# Altium schematic sheet _3_OUTPUT_RELAY.SchDoc
size B
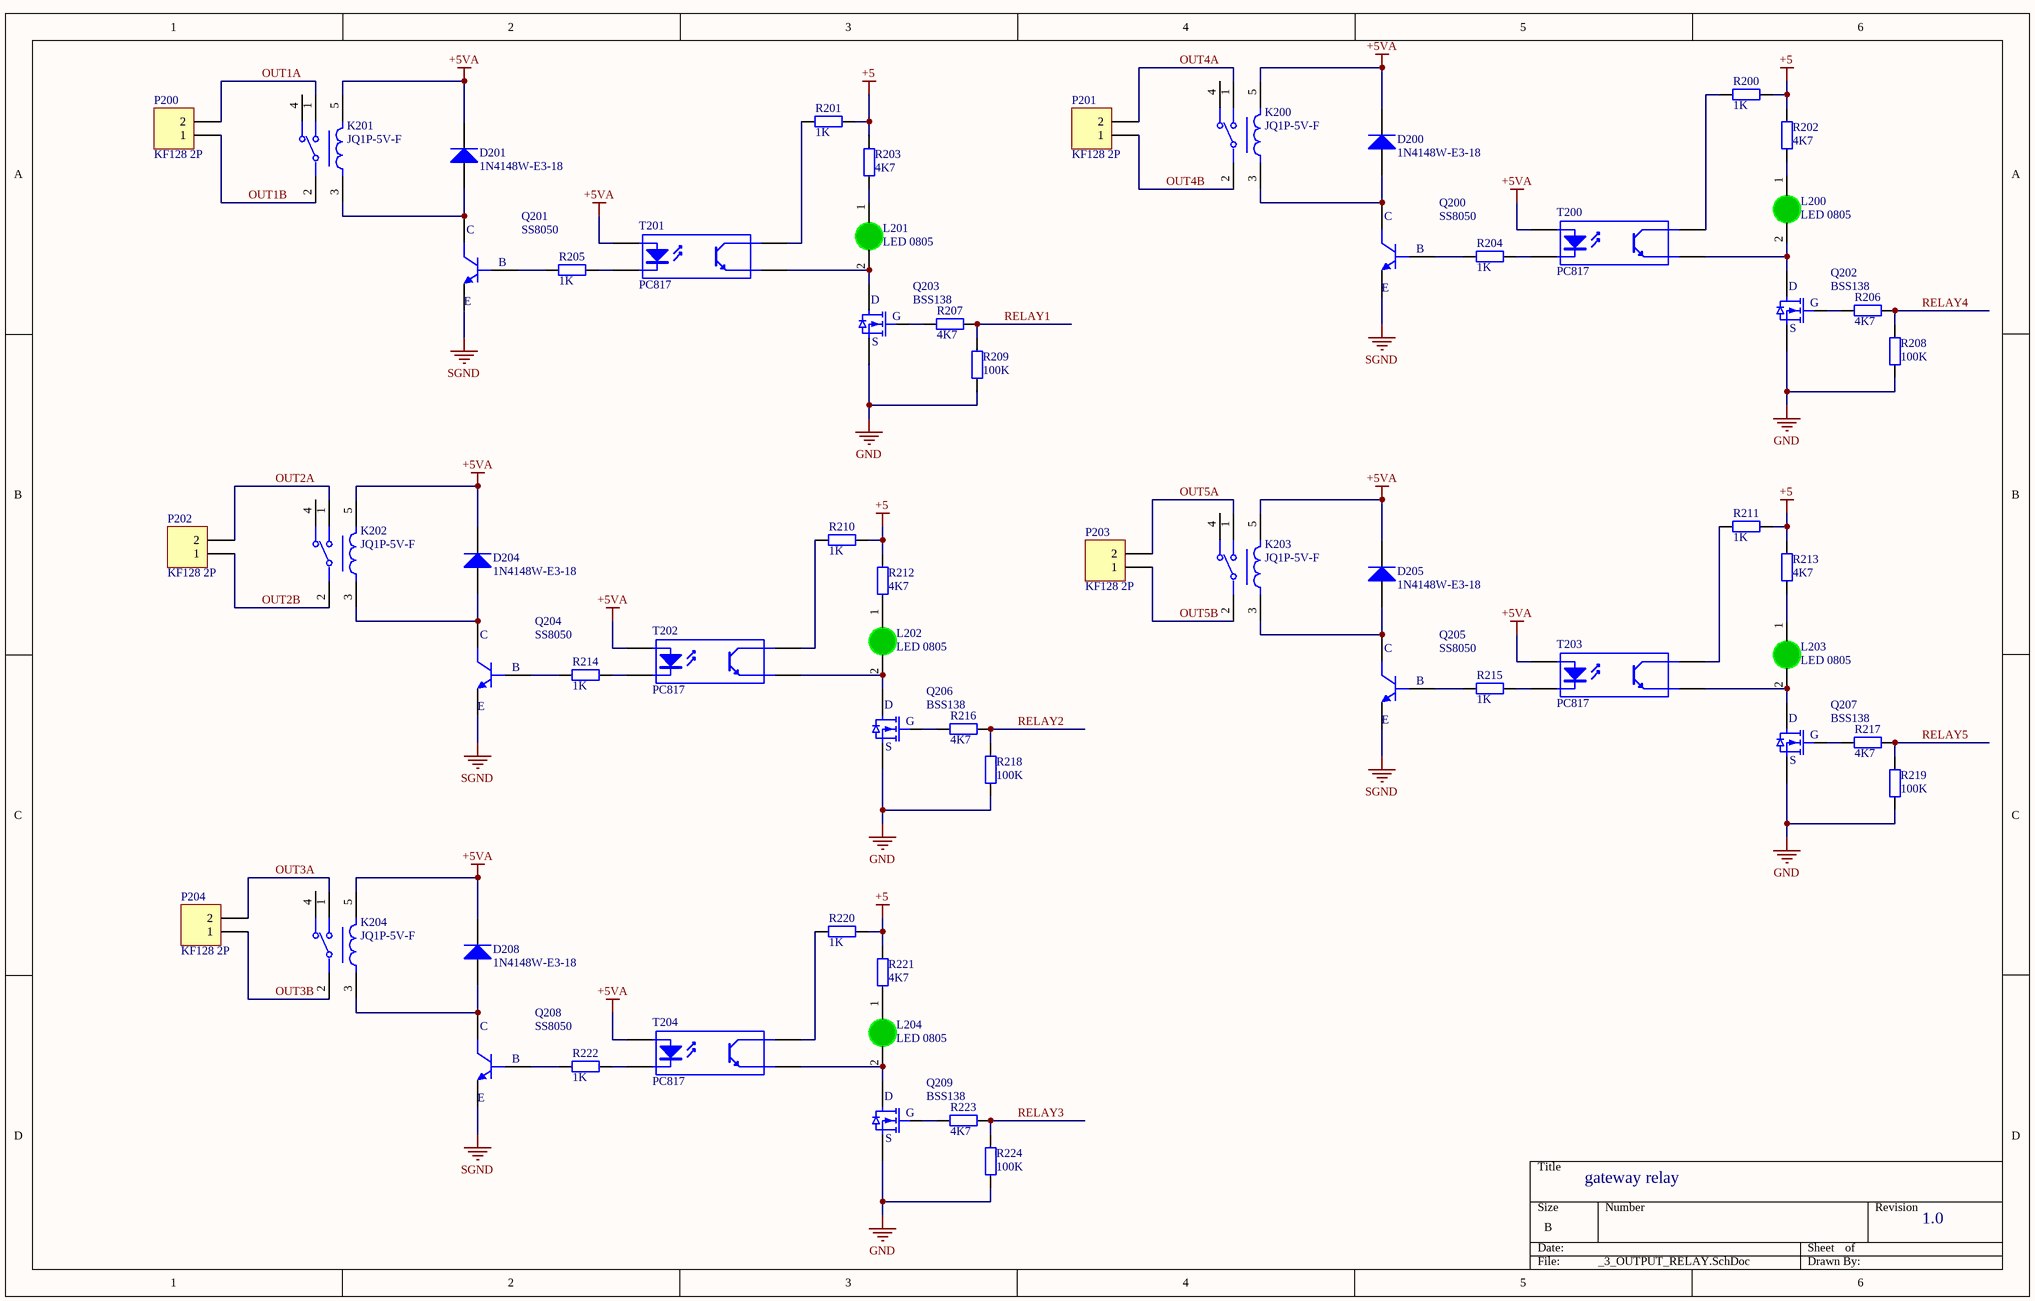
[diagram p0: _3_OUTPUT_RELAY.SchDoc]

## Parts
D200  1N4148W-E3-18  [SOD-123]
D201  1N4148W-E3-18  [SOD-123]
D204  1N4148W-E3-18  [SOD-123]
D205  1N4148W-E3-18  [SOD-123]
D208  1N4148W-E3-18  [SOD-123]
K200  JQ1P-5V-F  [FP-JQ1P-5V-F-MFG]
K201  JQ1P-5V-F  [FP-JQ1P-5V-F-MFG]
K202  JQ1P-5V-F  [FP-JQ1P-5V-F-MFG]
K203  JQ1P-5V-F  [FP-JQ1P-5V-F-MFG]
K204  JQ1P-5V-F  [FP-JQ1P-5V-F-MFG]
L200  LED 0805  [LED-0805-Green]
L201  LED 0805  [LED-0805-Green]
L202  LED 0805  [LED-0805-Green]
L203  LED 0805  [LED-0805-Green]
L204  LED 0805  [LED-0805-Green]
P200  KF128 2P  [KF128_2P]
P201  KF128 2P  [KF128_2P]
P202  KF128 2P  [KF128_2P]
P203  KF128 2P  [KF128_2P]
P204  KF128 2P  [KF128_2P]
Q200  SS8050  [SOT23_3]
Q201  SS8050  [SOT23_3]
Q202  BSS138  [SOT23_3]
Q203  BSS138  [SOT23_3]
Q204  SS8050  [SOT23_3]
Q205  SS8050  [SOT23_3]
Q206  BSS138  [SOT23_3]
Q207  BSS138  [SOT23_3]
Q208  SS8050  [SOT23_3]
Q209  BSS138  [SOT23_3]
R200  1K  [RESC-0603 (1608)]
R201  1K  [RESC-0603 (1608)]
R202  4K7  [RESC-0603 (1608)]
R203  4K7  [RESC-0603 (1608)]
R204  1K  [RESC-0603 (1608)]
R205  1K  [RESC-0603 (1608)]
R206  4K7  [RESC-0603 (1608)]
R207  4K7  [RESC-0603 (1608)]
R208  100K  [RESC-0603 (1608)]
R209  100K  [RESC-0603 (1608)]
R210  1K  [RESC-0603 (1608)]
R211  1K  [RESC-0603 (1608)]
R212  4K7  [RESC-0603 (1608)]
R213  4K7  [RESC-0603 (1608)]
R214  1K  [RESC-0603 (1608)]
R215  1K  [RESC-0603 (1608)]
R216  4K7  [RESC-0603 (1608)]
R217  4K7  [RESC-0603 (1608)]
R218  100K  [RESC-0603 (1608)]
R219  100K  [RESC-0603 (1608)]
R220  1K  [RESC-0603 (1608)]
R221  4K7  [RESC-0603 (1608)]
R222  1K  [RESC-0603 (1608)]
R223  4K7  [RESC-0603 (1608)]
R224  100K  [RESC-0603 (1608)]
T200  PC817  [OPTO TRANSISTOR_SMD-4]
T201  PC817  [OPTO TRANSISTOR_SMD-4]
T202  PC817  [OPTO TRANSISTOR_SMD-4]
T203  PC817  [OPTO TRANSISTOR_SMD-4]
T204  PC817  [OPTO TRANSISTOR_SMD-4]

## Nets
+5: R200.2 R201.2 R202.2 R203.2 R210.2 R211.2 R212.2 R213.2 R220.2 R221.2
+5VA: D200.2(K) D201.2(K) D204.2(K) D205.2(K) D208.2(K) K200.5(2_COIL) K201.5(2_COIL) K202.5(2_COIL) K203.5(2_COIL) K204.5(2_COIL) T200.1 T201.1 T202.1 T203.1 T204.1
GND: Q202.2(S) Q203.2(S) Q206.2(S) Q207.2(S) Q209.2(S) R208.1 R209.1 R218.1 R219.1 R224.1
SGND: Q200.2(E) Q201.2(E) Q204.2(E) Q205.2(E) Q208.2(E)
OUT1A: K201.1(N.O.) P200.2
OUT1B: K201.2(COM) P200.1
OUT2A: K202.1(N.O.) P202.2
OUT2B: K202.2(COM) P202.1
OUT3A: K204.1(N.O.) P204.2
OUT3B: K204.2(COM) P204.1
OUT4A: K200.1(N.O.) P201.2
OUT4B: K200.2(COM) P201.1
OUT5A: K203.1(N.O.) P203.2
OUT5B: K203.2(COM) P203.1
RELAY1: R207.1 R209.2
RELAY2: R216.1 R218.2
RELAY3: R223.1 R224.2
RELAY4: R206.1 R208.2
RELAY5: R217.1 R219.2
NetD200_1: D200.1(A) K200.3(1_COIL) Q200.3(C)
NetD201_1: D201.1(A) K201.3(1_COIL) Q201.3(C)
NetD204_1: D204.1(A) K202.3(1_COIL) Q204.3(C)
NetD205_1: D205.1(A) K203.3(1_COIL) Q205.3(C)
NetD208_1: D208.1(A) K204.3(1_COIL) Q208.3(C)
NetL200_1: L200.1(A) R202.1
NetL200_2: L200.2(K) Q202.3(D) T200.3
NetL201_1: L201.1(A) R203.1
NetL201_2: L201.2(K) Q203.3(D) T201.3
NetL202_1: L202.1(A) R212.1
NetL202_2: L202.2(K) Q206.3(D) T202.3
NetL203_1: L203.1(A) R213.1
NetL203_2: L203.2(K) Q207.3(D) T203.3
NetL204_1: L204.1(A) R221.1
NetL204_2: L204.2(K) Q209.3(D) T204.3
NetQ200_1: Q200.1(B) R204.1
NetQ201_1: Q201.1(B) R205.1
NetQ202_1: Q202.1(G) R206.2
NetQ203_1: Q203.1(G) R207.2
NetQ204_1: Q204.1(B) R214.1
NetQ205_1: Q205.1(B) R215.1
NetQ206_1: Q206.1(G) R216.2
NetQ207_1: Q207.1(G) R217.2
NetQ208_1: Q208.1(B) R222.1
NetQ209_1: Q209.1(G) R223.2
NetR200_1: R200.1 T200.4
NetR201_1: R201.1 T201.4
NetR204_2: R204.2 T200.2
NetR205_2: R205.2 T201.2
NetR210_1: R210.1 T202.4
NetR211_1: R211.1 T203.4
NetR214_2: R214.2 T202.2
NetR215_2: R215.2 T203.2
NetR220_1: R220.1 T204.4
NetR222_2: R222.2 T204.2

Not connected (* = marked no-connect by the designer): K200 4(N.C.); K201 4(N.C.); K202 4(N.C.); K203 4(N.C.); K204 4(N.C.)

## Notes on the sheet
- gateway relay
- 1.0

## Library data of the parts
D200 D201 D204 D205 D208 = 1N4148-W-7: DIODE GEN PURP 100V 300MA SOD123; MPN: 1N4148W-7-F; MFR: Diodes Incorporated; Solder: SMT; Value: 100V/300MA
K200-K204 = CMP-05607-000163-1: RELAY GEN PURPOSE SPDT 10A 5V; Relay Type: General Purpose; Coil Current: 80mA; Power Rating: 400mW; Operate Time: 20ms; Coil Resistance: 62.5R; Release Time: 10ms; Voltage Rating (AC): 250V; Max Voltage Rating (DC): 110V; Coil Type: Non-Latching; Height: 15.6mm; Mount: Through Hole; Coil Voltage (DC): 5V; Package Quantity: 100; Width: 20mm; Lead Free: Lead Free; Throw Configuration: SPDT; Max Operating Temperature: 70°C; Contact Current Rating: 10A; Termination: PC Pin; Series: JQ; Length: 20mm; Contact Material: Tin; Weight: 7g; RoHS Compliant: Yes; Number of Pins: 5; Depth: 10mm; Packaging: Bulk; Coil Power: 400mW; Max Voltage Rating (AC): 250V; Power Consumption: 400mW; Min Operating Temperature: -40°C
L200-L204 = LED 0805 Xanh La: Dán; Don_Vi: Con; Ma_Hang: MH002326; Ten_Linh_Kien: LED 0805 Màu Xanh Lá (Green); Ghi_Chu: *; Kieu_Chan: *; Chung_Loai: Dán
P200-P204 = KF128 2P: Header, 2-Pin, pitch 5.08mm; MPN: KF128-2P; Solder: WAVE
Q200 Q201 Q204 Q205 Q208 = 2SC1815: TRANS NPN 50V 0.15A SOT23-3; Solder: SMT; MPN: 2SC1815; Value: 2SC1815
Q202 Q203 Q206 Q207 Q209 = 2N7002,215: MOSFET N-CH 60V 300MA SOT-23; Solder: SMT; CompanyID: VT-00926; Value: 60V/0.3A; MPN: 2N7002,215
R200 R201 R204 R205 R210 R211 R214 R215 R220 R222 = RC0603FR-071KL: RES SMD 1 KOHM 1% 1/10W 0603; CompanyID: VT-00574; Solder: SMT; MPN: RC0603FR-071KL; Value: 1K; Category: RESISTOR
R202 R203 R206 R207 R212 R213 R216 R217 R221 R223 = RC0603FR-074K7L: RES SMD 4.7K OHM 1% 1/10W 0603; CompanyID: VT-00327; Solder: SMT; MPN: RC0603FR-074K7L; Value: 4K7; Category: RESISTOR
R208 R209 R218 R219 R224 = RC0603FR-07100KL: RES SMD 100K OHM 1% 1/10W 0603; CompanyID: VT-00332; Solder: SMT; MPN: RC0603FR-07100KL; Value: 100K; Category: RESISTOR
T200-T204 = HCPL-817-500E: OPTOISOLATOR 5KV TRANSISTOR 4SMD; Value: 70V/50mA; Solder: SMT; CompanyID: VT-00147; MPN: HCPL-817-500E